# Altium schematic sheet Backplane_Breakout_Adapter_Connectors.SchDoc: Board Connectors
size B; Date: 10/01/2021; Author: Sample Author; Organization: ORGANIZATION; Address1: ADDRESS 1; Address2: ADDRESS 2; Address3: ADDRESS 3; Address4: ADDRESS 4; Revision: -; SheetNumber: 1; SheetTotal: 3; ENG_APP_DATE: --/--/--; DSN_APP_DATE: --/--/--; CHK_APP_DATE: --/--/--
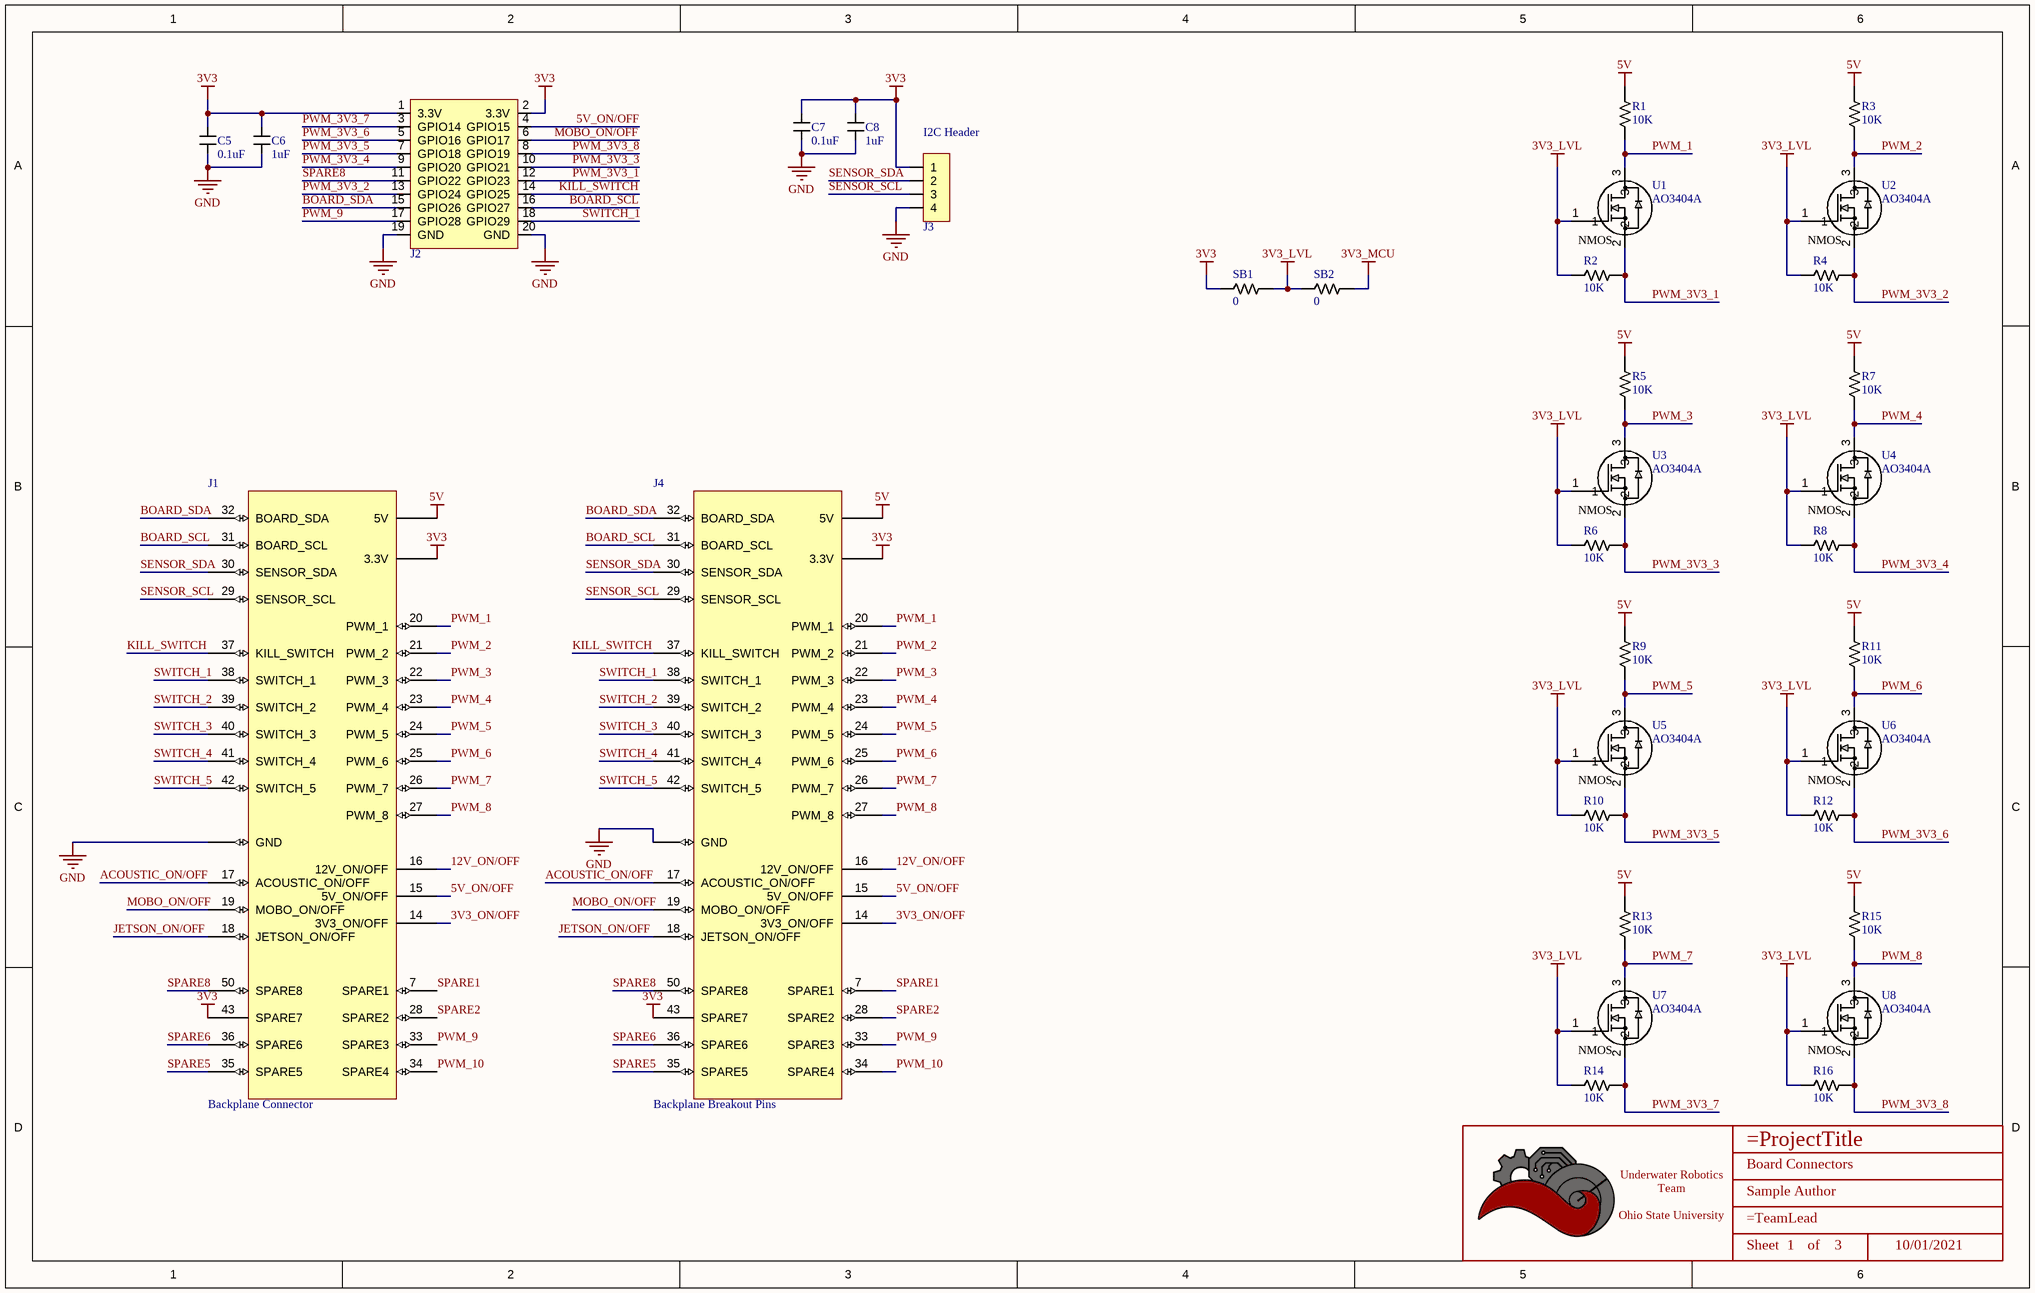
[diagram p0: Backplane_Breakout_Adapter_Connectors.SchDoc]

## Parts
*  Title_Block  [LOGO]  (value not drawn)  (graphical)
C5  value 0.1uF  [CAPACITOR_0603]  (hidden comment: 100nF Ceramic 6.3V)
C6  value 1uF  [CAPACITOR_0603]  (hidden comment: 1uF Ceramic 16V)
C7  value 0.1uF  [CAPACITOR_0603]  (hidden comment: 100nF Ceramic 6.3V)
C8  value 1uF  [CAPACITOR_0603]  (hidden comment: 1uF Ceramic 16V)
J1  Backplane Connector  [BACKPLANE_EDGE_CONN]
J2  RP2040 GPIO Header  [HEADER_MIRRORED_2x10PIN_2.54MM]  (value not drawn)
J3  CONN HEADER VERT 4POS 2.54MM  [HEADER_MIRRORED_4PIN_2.54MM]  (value not drawn)
J4  Backplane Breakout Pins  [HEADER_2X28PIN_2.54MM]
R1  Value  (Ohms): 10K  [RESISTOR_0603]  (hidden comment: 10k Ohm 5% 1/10W)
R2  Value  (Ohms): 10K  [RESISTOR_0603]  (hidden comment: 10k Ohm 5% 1/10W)
R3  Value  (Ohms): 10K  [RESISTOR_0603]  (hidden comment: 10k Ohm 5% 1/10W)
R4  Value  (Ohms): 10K  [RESISTOR_0603]  (hidden comment: 10k Ohm 5% 1/10W)
R5  Value  (Ohms): 10K  [RESISTOR_0603]  (hidden comment: 10k Ohm 5% 1/10W)
R6  Value  (Ohms): 10K  [RESISTOR_0603]  (hidden comment: 10k Ohm 5% 1/10W)
R7  Value  (Ohms): 10K  [RESISTOR_0603]  (hidden comment: 10k Ohm 5% 1/10W)
R8  Value  (Ohms): 10K  [RESISTOR_0603]  (hidden comment: 10k Ohm 5% 1/10W)
R9  Value  (Ohms): 10K  [RESISTOR_0603]  (hidden comment: 10k Ohm 5% 1/10W)
R10  Value  (Ohms): 10K  [RESISTOR_0603]  (hidden comment: 10k Ohm 5% 1/10W)
R11  Value  (Ohms): 10K  [RESISTOR_0603]  (hidden comment: 10k Ohm 5% 1/10W)
R12  Value  (Ohms): 10K  [RESISTOR_0603]  (hidden comment: 10k Ohm 5% 1/10W)
R13  Value  (Ohms): 10K  [RESISTOR_0603]  (hidden comment: 10k Ohm 5% 1/10W)
R14  Value  (Ohms): 10K  [RESISTOR_0603]  (hidden comment: 10k Ohm 5% 1/10W)
R15  Value  (Ohms): 10K  [RESISTOR_0603]  (hidden comment: 10k Ohm 5% 1/10W)
R16  Value  (Ohms): 10K  [RESISTOR_0603]  (hidden comment: 10k Ohm 5% 1/10W)
SB1  Value  (Ohms): 0  [RESISTOR_0603]  (hidden comment: 0 Ohm Jumper No Fit)
SB2  Value  (Ohms): 0  [RESISTOR_0603]  (hidden comment: 0 Ohm Jumper No Fit)
U1  AO3404A  [SOT-23-3]
U2  AO3404A  [SOT-23-3]
U3  AO3404A  [SOT-23-3]
U4  AO3404A  [SOT-23-3]
U5  AO3404A  [SOT-23-3]
U6  AO3404A  [SOT-23-3]
U7  AO3404A  [SOT-23-3]
U8  AO3404A  [SOT-23-3]

## Nets
3V3: C5.1 C6.1 C7.1 C8.1 J1.1*6(3.3V) J1.43(SPARE7) J2.1(3.3V) J2.2(3.3V) J3.1 J4.1*6(3.3V) J4.43(SPARE7) SB1.2
3V3_LVL: R2.2 R4.2 R6.2 R8.2 R10.2 R12.2 R14.2 R16.2 SB1.1 SB2.2 U1.1 U2.1 U3.1 U4.1 U5.1 U6.1 U7.1 U8.1
3V3_MCU: SB2.1
5V: J1.11*6(5V) J4.11*6(5V) R1.1 R3.1 R5.1 R7.1 R9.1 R11.1 R13.1 R15.1
GND: C5.2 C6.2 C7.2 C8.2 J1.4*12(GND) J2.19(GND) J2.20(GND) J3.4 J4.4*12(GND)
3V3_ON/OFF: J1.14(3V3_ON/OFF) J4.14(3V3_ON/OFF)
5V_ON/OFF: J1.15(5V_ON/OFF) J2.4(GPIO15) J4.15(5V_ON/OFF)
12V_ON/OFF: J1.16(12V_ON/OFF) J4.16(12V_ON/OFF)
ACOUSTIC_ON/OFF: J1.17(ACOUSTIC_ON/OFF) J4.17(ACOUSTIC_ON/OFF)
BOARD_SCL: J1.31(BOARD_SCL) J2.16(GPIO27) J4.31(BOARD_SCL)
BOARD_SDA: J1.32(BOARD_SDA) J2.15(GPIO26) J4.32(BOARD_SDA)
JETSON_ON/OFF: J1.18(JETSON_ON/OFF) J4.18(JETSON_ON/OFF)
KILL_SWITCH: J1.37(KILL_SWITCH) J2.14(GPIO25) J4.37(KILL_SWITCH)
MOBO_ON/OFF: J1.19(MOBO_ON/OFF) J2.6(GPIO17) J4.19(MOBO_ON/OFF)
PWM_1: J1.20(PWM_1) J4.20(PWM_1) R1.2 U1.3
PWM_2: J1.21(PWM_2) J4.21(PWM_2) R3.2 U2.3
PWM_3: J1.22(PWM_3) J4.22(PWM_3) R5.2 U3.3
PWM_3V3_1: J2.12(GPIO23) R2.1 U1.2
PWM_3V3_2: J2.13(GPIO24) R4.1 U2.2
PWM_3V3_3: J2.10(GPIO21) R6.1 U3.2
PWM_3V3_4: J2.9(GPIO20) R8.1 U4.2
PWM_3V3_5: J2.7(GPIO18) R10.1 U5.2
PWM_3V3_6: J2.5(GPIO16) R12.1 U6.2
PWM_3V3_7: J2.3(GPIO14) R14.1 U7.2
PWM_3V3_8: J2.8(GPIO19) R16.1 U8.2
PWM_4: J1.23(PWM_4) J4.23(PWM_4) R7.2 U4.3
PWM_5: J1.24(PWM_5) J4.24(PWM_5) R9.2 U5.3
PWM_6: J1.25(PWM_6) J4.25(PWM_6) R11.2 U6.3
PWM_7: J1.26(PWM_7) J4.26(PWM_7) R13.2 U7.3
PWM_8: J1.27(PWM_8) J4.27(PWM_8) R15.2 U8.3
PWM_9: J1.33(SPARE3) J2.17(GPIO28) J4.33(SPARE3)
PWM_10: J1.34(SPARE4) J4.34(SPARE4)
SENSOR_SCL: J1.29(SENSOR_SCL) J3.3 J4.29(SENSOR_SCL)
SENSOR_SDA: J1.30(SENSOR_SDA) J3.2 J4.30(SENSOR_SDA)
SPARE1: J1.7(SPARE1) J4.7(SPARE1)
SPARE2: J1.28(SPARE2) J4.28(SPARE2)
SPARE5: J1.35(SPARE5) J4.35(SPARE5)
SPARE6: J1.36(SPARE6) J4.36(SPARE6)
SPARE8: J1.50(SPARE8) J2.11(GPIO22) J4.50(SPARE8)
SWITCH_1: J1.38(SWITCH_1) J2.18(GPIO29) J4.38(SWITCH_1)
SWITCH_2: J1.39(SWITCH_2) J4.39(SWITCH_2)
SWITCH_3: J1.40(SWITCH_3) J4.40(SWITCH_3)
SWITCH_4: J1.41(SWITCH_4) J4.41(SWITCH_4)
SWITCH_5: J1.42(SWITCH_5) J4.42(SWITCH_5)

## Notes on the sheet
- (near J3) I2C Header
- DWG. NO.
- REV.
- SHT.
- THIS DOCUMENT AND THE DATA DISCLOSED HEREIN OR HEREWITH IS THE PROPERTY OF ALTIUM LIMITED AND MAY BE FREELY DISTRIBUTED IN WHOLE. NO RIGHTS ARE RESERVED OR EXPRESS OR IMPLIED WARANTEE GIVEN.
- REVISION
- DESCRIPTION
- DATE
- APPROVED
- ENG:
- APPROVALS
- PROJECT
- DSN:
- CHK:
- REFERENCE DOCUMENTS
- PROJECT REVISION:
- TITLE
- DOCUMENT REVISION:
- DESIGN ITEM:
- BOM:
- FAB DWG:
- PCB DWG:
- ASSY DWG:
- SCALE:
- SIZE
- B
- CAGE CODE
- FILE NAME
- DWG NO.
- SHEET
- OF
- REV
- (in symbol AO3404A) NMOS
- (in symbol Title_Block) Underwater Robotics Team / Ohio State University; Sheet; of

## Library data of the parts
* = Title_Block: UWRT Schematic Title Block Template / Created June 2021, Dylan Trainor
C5 C7 = CAPACITOR_0.1uF_0603: Cap 100nF 6.3V +/-10% / Ceramic 0603; Made By: Flip B; ComponentLink1Description: Datsheet; ComponentLink1URL: https://www.mouser.com/datasheet/2/212/KEM_C1002_X7R_SMD-1102033.pdf; Tolerance: +/- 10%; Voltage: 6.3V; Supplier 1: Digi-Key; Supplier Part Number 1: 399-15351-1-ND
C6 C8 = CAPACITOR_1uF_0603: Cap 1uF 16V +/-10% / Ceramic 0603; Made By: Flip B; Tolerance: +/- 10%; Voltage: 16V; Supplier 1: Digi-Key; Supplier Part Number 1: 399-7847-1-ND
J1 J4 = BACKBOARD_EDGE_CONN: Titan Backplane Edge Connector; pin to pad: 1*6>1+2+3+54+55+56 4*12>4+5+6+8+9+10+47+48+49+51+52+53 11*6>11+12+13+44+45+46
J2 = HEADER_2x10PIN_2.54MM_RP2040_GPIO: CONN HEADER VERT 20POS 2.54MM; Made By: Robert Pafford; Supplier 1: Digi-Key; Supplier Part Number 1: Z8747-ND
J3 = HEADER_4PIN_2.54MM: Made By: Robert Pafford; Supplier 1: Digi-Key; Supplier Part Number 1: S1012E-04-ND
R1-R16 = RESISTOR_10K_0603: RES 10k OHM 5% 1/10W 0603; Tolerance: +/- 5%; Wattage: 1/8W; Made By: Robert Pafford; ComponentLink1Description: Datasheet; ComponentLink1URL: https://www.bourns.com/docs/product-datasheets/CRxxxxx.pdf; Supplier: Digikey; Digikey Part Numer: CR0603-JW-104ELFTR-ND; Supplier 1: Digi-Key; Supplier Part Number 1: 2019-RK73B1JTTD103JCT-ND
SB1 SB2 = JUMPER_0_0603: 0 Ohm Jumper No Fit for Solder Bridge; Made By: Robert Pafford; ComponentLink1Description: Digikey; ComponentLink1URL: https://www.digikey.com/en/products/detail/koa-speer-electronics-inc/RK73B1JTTD101J/9844701
U1-U8 = AO3404A: N-Channel 30 V 5.8A (Ta) 1.4W (Ta) Surface Mount SOT-23-3; Vendor: Alpha & Omega Semiconductor Inc.; SourceLibrary: ON_Semiconductor_2020-01-13; Vgs (Max): 3V @ 5.8A, 10V; Vgs (th): 3V @ 250µA; Vdss: 30V; Rds (on): 28mOhm @ 5.8A, 10V; Amp Rating: 5.8 A; FET Type: N-Channel; Package: SOT23-3L; Manufacturer _Part_Number: AO3404A; Power Dissipation: 1.4W (Ta); Supplier 1: Digi-Key; Supplier Part Number 1: 785-1004-1-ND; Created By: Dylan T